# EAGLE design ClockCtrl (EAGLE 9.6.2)

## Sheet 1 of 2
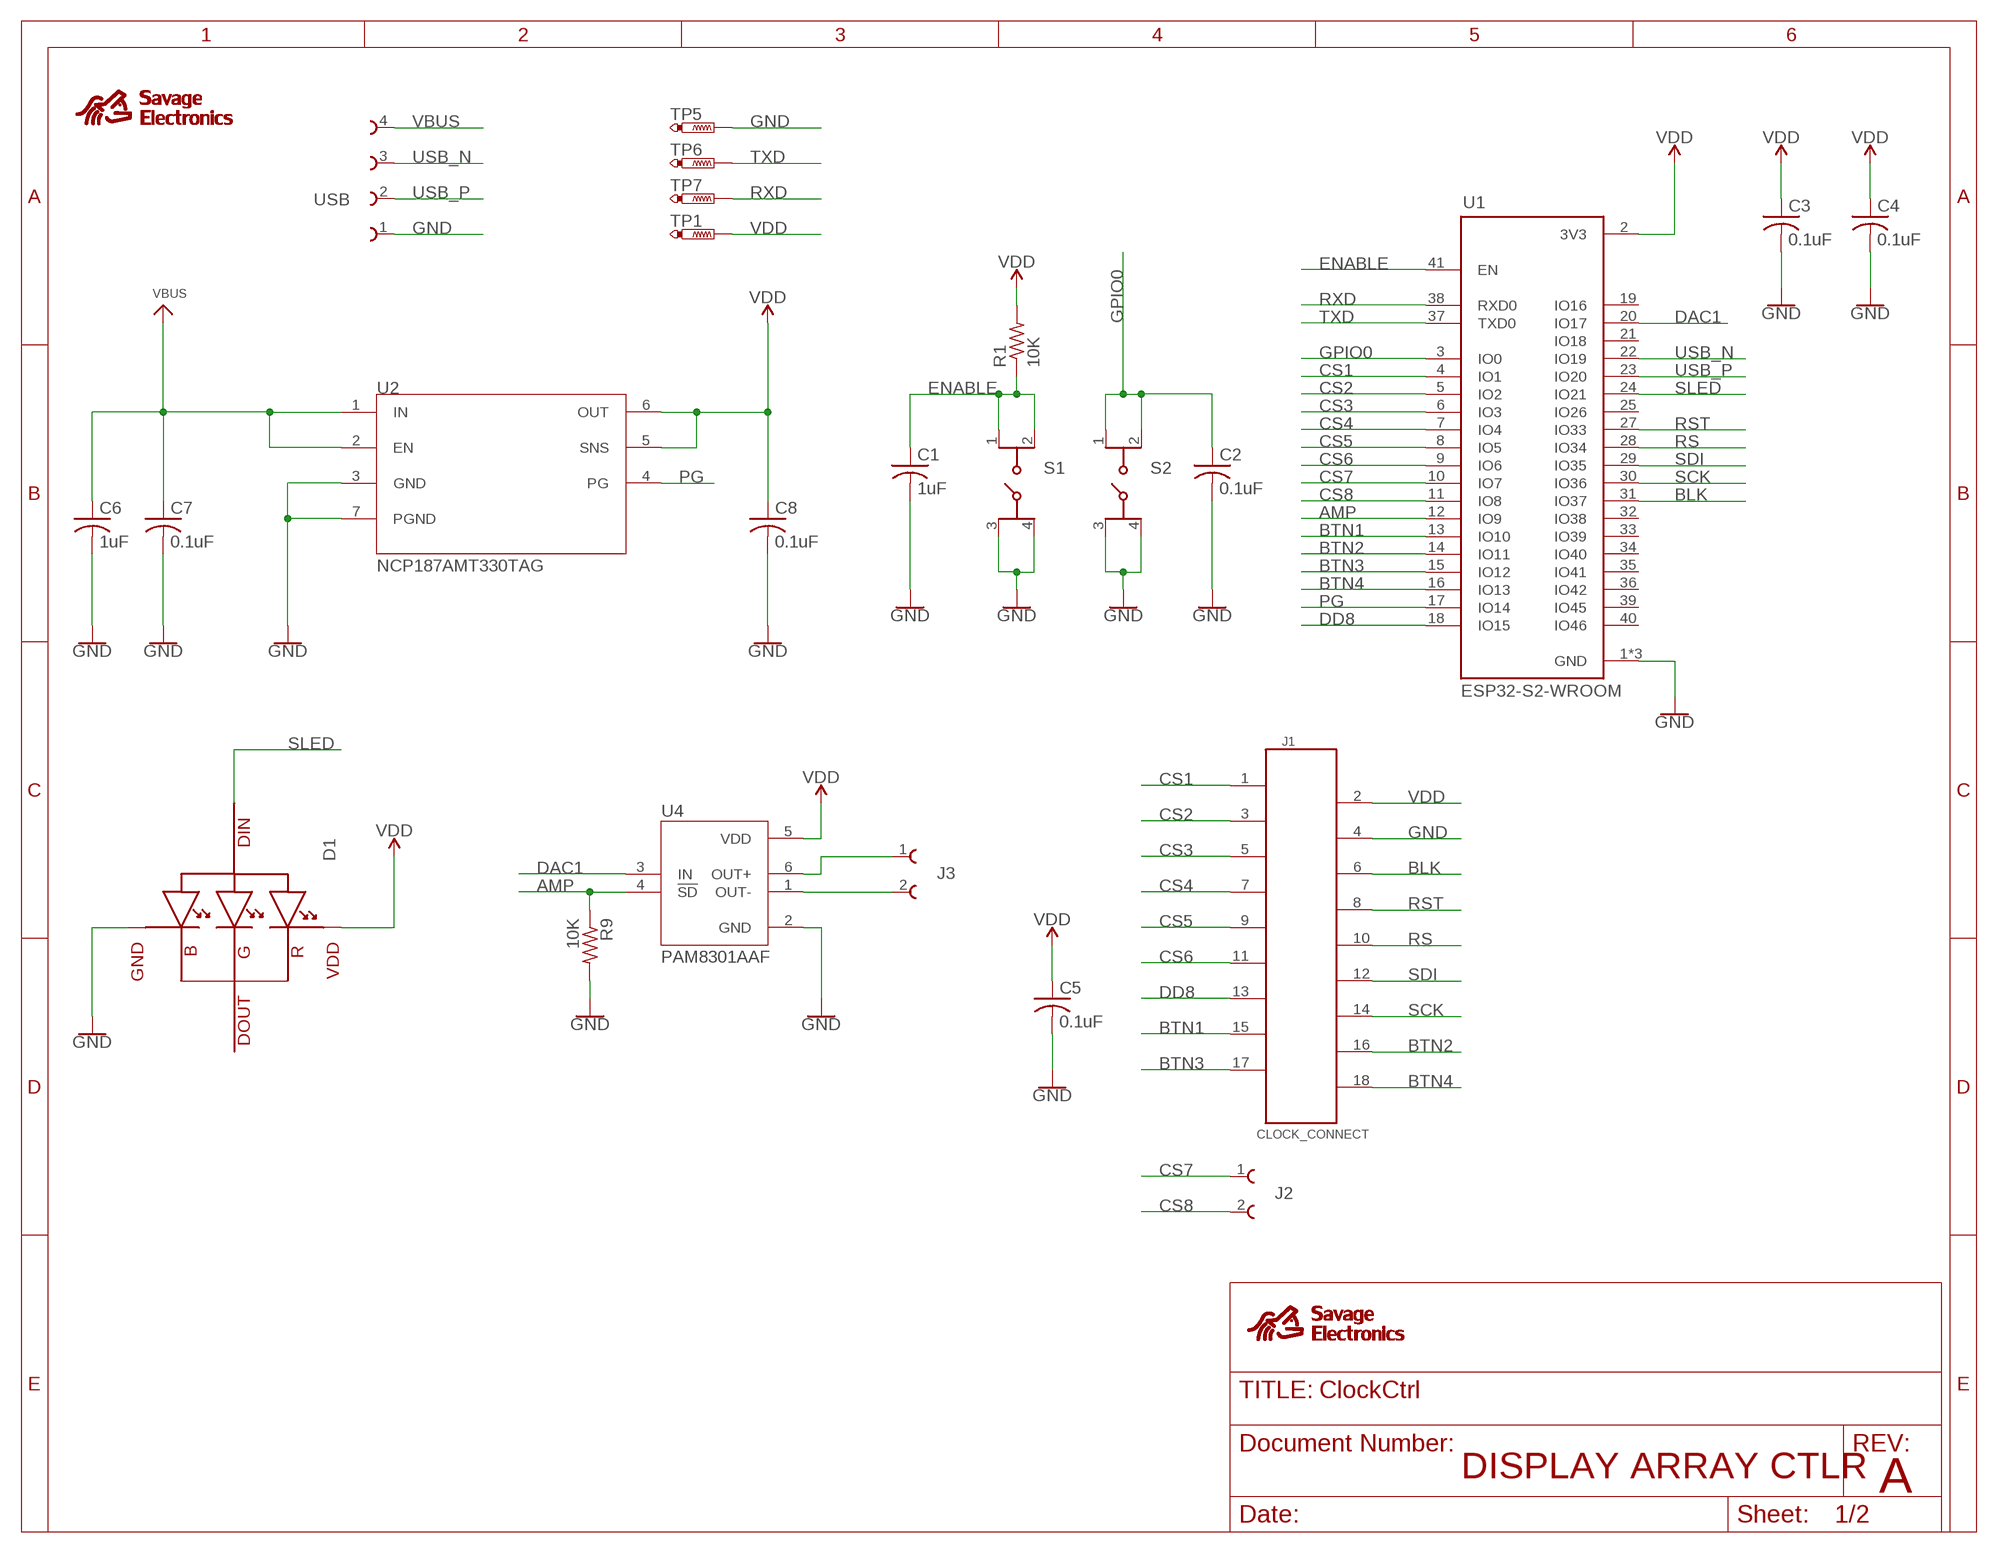
[diagram p0: schematic, sheet 1]

### Parts
C1  1uF  C-USC0805  [C0805]
C2  0.1uF  C-USC0603  [C0603]
C3  0.1uF  C-USC0603  [C0603]
C4  0.1uF  C-USC0603  [C0603]
C5  0.1uF  C-USC0603  [C0603]
C6  1uF  C-USC0603  [C0603]
C7  0.1uF  C-USC0603  [C0603]
C8  0.1uF  C-USC0603  [C0603]
D1  SK6812  [20X20]
J1  CLOCK_CONNECT  [CLOCKC_FOOTPRINT]
J2  62000211121  [62000211121]
J3  62000211121  [62000211121]
R1  10K  R-US_R0603  [R0603]
R9  10K  R-US_R0603  [R0603]
S1  434123025826  [434123025826]
S2  434123025826  [434123025826]
TP1  PTR1TP12R  [TP12R]
TP5  PTR1TP12R  [TP12R]
TP6  PTR1TP12R  [TP12R]
TP7  PTR1TP12R  [TP12R]
U1  ESP32-S2-WROOM  [XCVR_ESP32-S2-WROOM]
U2  NCP187AMT330TAG  [SON65P250X250X80-7N]
U4  PAM8301AAF  [SOT95P280X145-6N]
U$1  SE_SMALL_FSILK  [SE_SMALL_FACESILK]
U$3  SE_SMALL_SILK  [SE_SMALL_SILK]
USB  62000411121  [62000411121]

### Nets
AMP: R9.1 U1.12(IO9) U4.4(!SD)
BLK: J1.6 U1.31(IO37)
BTN1: J1.15 U1.13(IO10)
BTN2: J1.16 U1.14(IO11)
BTN3: J1.17 U1.15(IO12)
BTN4: J1.18 U1.16(IO13)
CS1: J1.1 U1.4(IO1)
CS2: J1.3 U1.5(IO2)
CS3: J1.5 U1.6(IO3)
CS4: J1.7 U1.7(IO4)
CS5: J1.9 U1.8(IO5)
CS6: J1.11 U1.9(IO6)
CS7: J2.1 U1.10(IO7)
CS8: J2.2 U1.11(IO8)
DAC1: U1.20(IO17) U4.3(IN)
DD8: J1.13 U1.18(IO15)
ENABLE: C1.1 R1.1 S1.1 S1.2 U1.41(EN)
GND: C1.2 C2.2 C3.2 C4.2 C5.2 C6.2 C7.2 C8.2 D1.3(GND) J1.4 R9.2 S1.3 S1.4 S2.3 S2.4 TP5.TP U1.1(GND) U1.26(GND) U1.42(GND) U2.3(GND) U2.7(PGND) U4.2(GND) USB.1
GPIO0: C2.1 S2.1 S2.2 U1.3(IO0)
N$5: J3.2 U4.1(OUT-)
N$9: J3.1 U4.6(OUT+)
PG: U1.17(IO14) U2.4(PG)
RS: J1.10 U1.28(IO34)
RST: J1.8 U1.27(IO33)
RXD: TP7.TP U1.38(RXD0)
SCK: J1.14 U1.30(IO36)
SDI: J1.12 U1.29(IO35)
SLED: D1.4(DIN) U1.24(IO21)
TXD: TP6.TP U1.37(TXD0)
USB_N: U1.22(IO19) USB.3
USB_P: U1.23(IO20) USB.2
VBUS: C6.1 C7.1 U2.1(IN) U2.2(EN) USB.4
VDD: C3.1 C4.1 C5.1 C8.1 D1.1(VDD) J1.2 R1.2 TP1.TP U1.2(3V3) U2.5(SNS) U2.6(OUT) U4.5(VDD)
Unconnected: D1.2(DOUT) U1.19(IO16) U1.21(IO18) U1.25(IO26) U1.32(IO38) U1.33(IO39) U1.34(IO40) U1.35(IO41) U1.36(IO42) U1.39(IO45) U1.40(IO46)

### Notes on the sheet
- DISPLAY ARRAY CTLR
- A

## Sheet 2 of 2
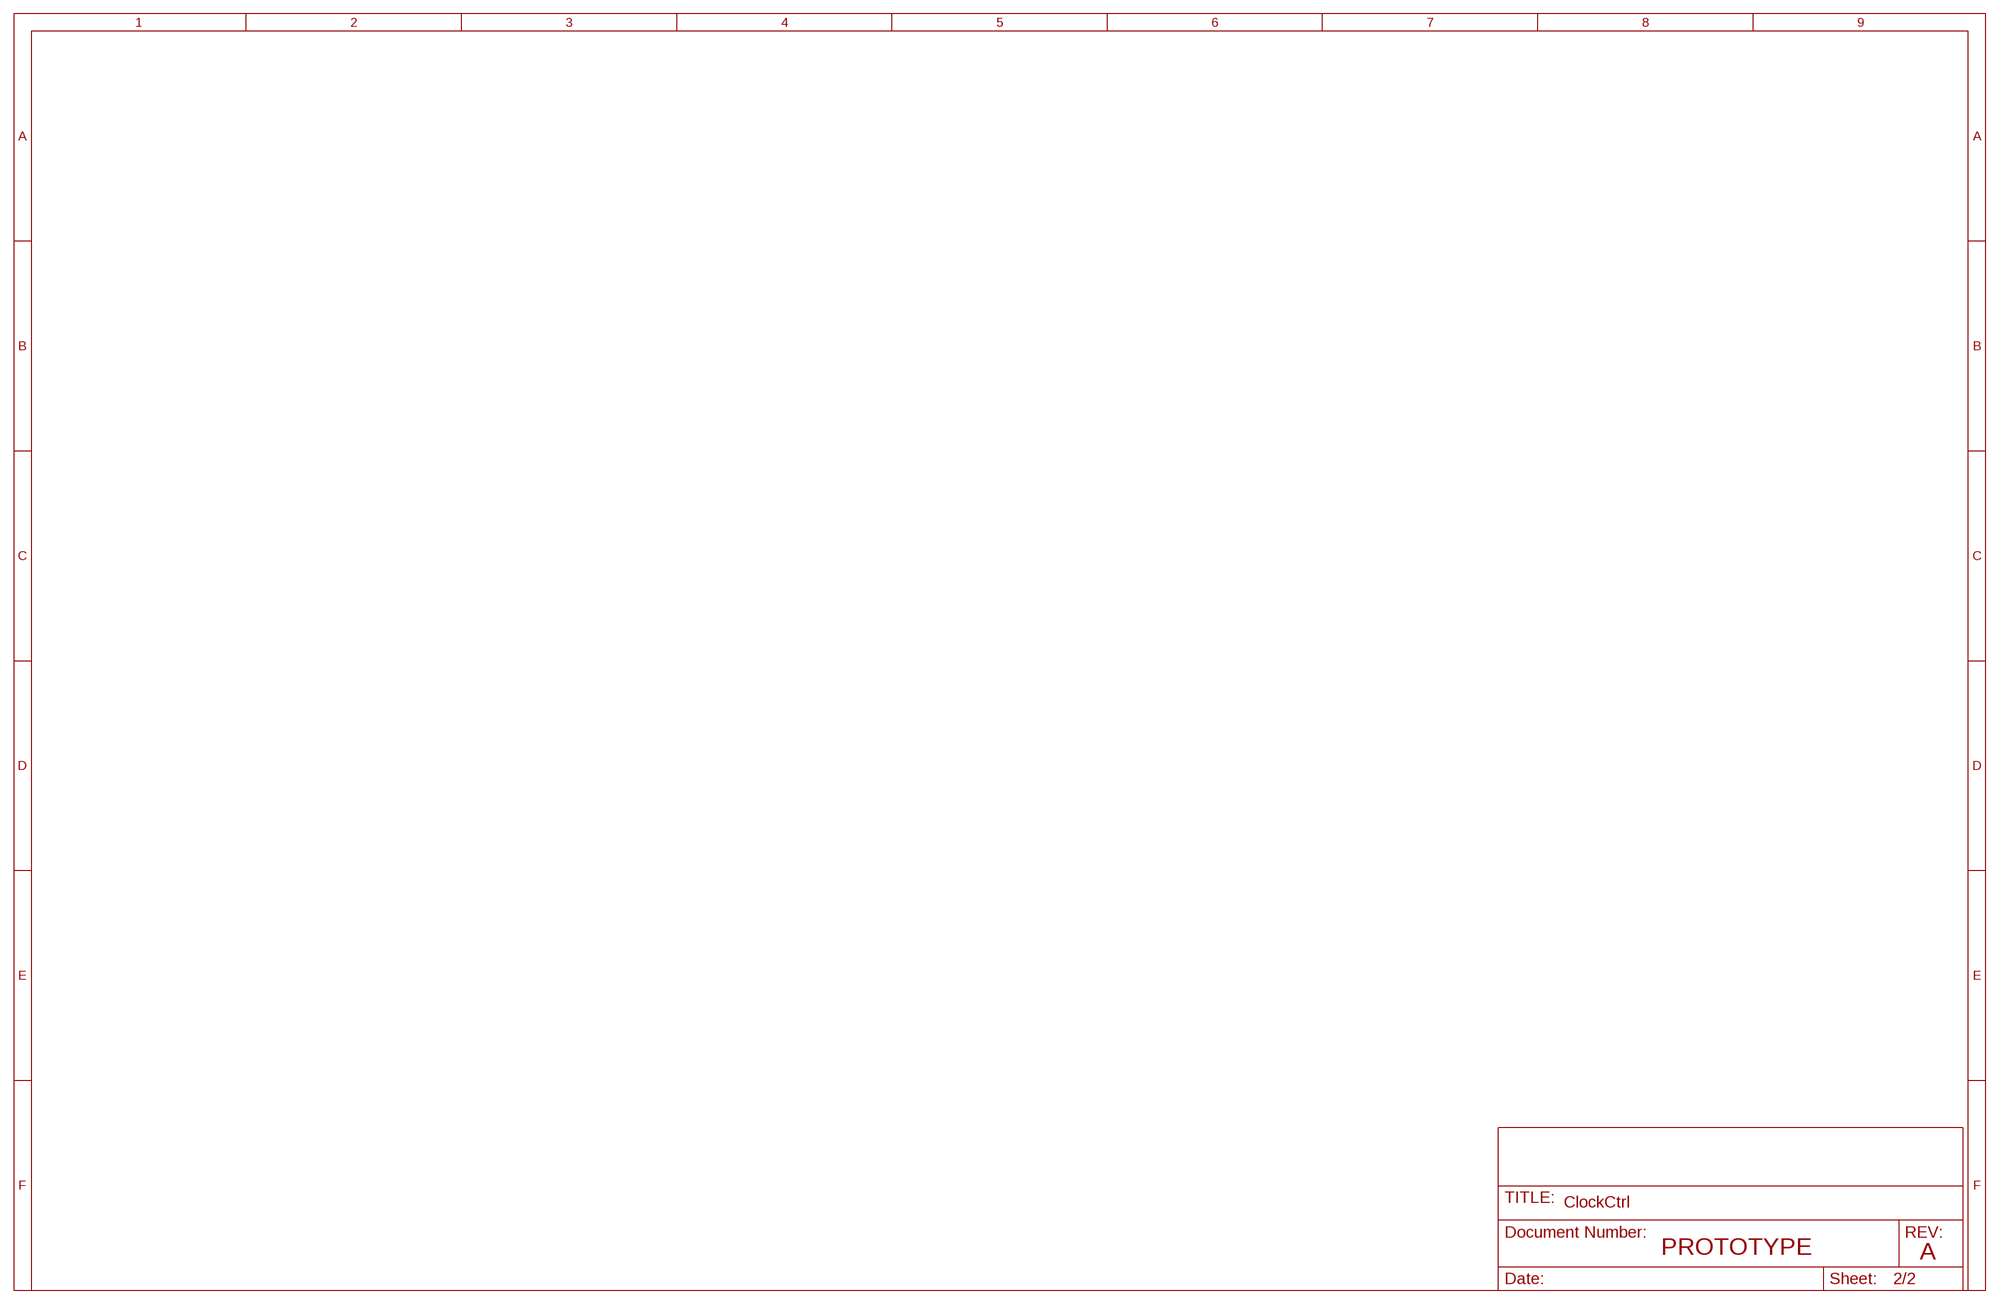
[diagram p1: schematic, sheet 2]

### Notes on the sheet
- PROTOTYPE | A

## Library data of the parts
C1-C8 = Adafruit:C-US: CAPACITOR, American symbol
D1 = ledRGB:SK6812
J1 = Eagle_BOARD-TO-BOARD_CONNECTORS (rev18b):CLOCK_CONNECT
J2 J3 = Eagle_BOARD-TO-BOARD_CONNECTORS (rev18b):62000211121: WR-PHD 2.00mm Pin Header, 2 Pins=>Code : Con_BTB_PHD_2.00_1_THT_62000211121 <http://katalog.we-online.de/media/images/eican/Con_BTB_PHD_2.00_1_THT_6200xx11121_pf2.jpg> Details see: http://katalog.we-online.de/en/em/620_0xx_111_21 Created 2014-06-03, Karrer Zheng 2014 (C) Würth Elektronik
R1 R9 = Adafruit:R-US_: RESISTOR, American symbol
S1 S2 = Eagle_SWITCHES (rev18c):434123025826: 4.2 x 3.2 mm J-Bend SMD Tact Switch WS-TASV MATERIAL PROPERTIES: Cover Material Stainless Steel Actuator Material LCP Actuator Flammability Rating UL94 V-0 Actuator Color White;​ Black Frame Material LCP Frame Flammability Rating UL94 V-0 Frame Color Black Contact Material Stainless Steel Contact Plating Silver Terminal Material Copper Alloy Terminal Plating Silver ELECTRICAL PROPERTIES: Rated Current [1] 50 mA Rated Voltage 16 V (DC) Contact Resistance Initial 500 mΩ Contact Resistance After Life Test 1 Ω Insulation Resistance 100 MΩ Withstanding Voltage 250 V (AC) Bounce 10 ms MECHANICAL PROPERTIES: Operation Force 260 g;​ 160 g Life Cycle 50000 Times;​ 100000 Times GENERAL INFORMATION: Operating Temperature -40 °C up to +85 °C Storage Temperature (in original packaging) -40 °C up to +85 °C PACKAGING PROPERTIES: Packaging Tape and Reel Packaging Unit (Qty.) 2900 <http://katalog.we-online.de/media/images/v2/Family_WS-TASV-4341x30258x6_Gruppe.jpg> Details see: http://katalog.we-online.de/em/datasheet/434123025826.pdf 2017(C) Wurth Elektronik
TP1 TP5-TP7 = TestPoints:PTR1: TEST PIN
U1 = ESP32-S2-WROOM:ESP32-S2-WROOM: WiFi 802.11b/g/n Transceiver Module 2.4GHz PCB Trace Surface Mount Check prices <https://pricing.snapeda.com/parts/ESP32-S2-WROOM/Espressif%20Systems/view-part?ref=eda>; AVAILABILITY: Bad; DESCRIPTION: WiFi 802.11b/g/n Transceiver Module 2.4GHz PCB Trace Surface Mount; MF: Espressif Systems; MP: ESP32-S2-WROOM; PACKAGE: None; PRICE: None
U2 = NCP187AMT330TAG:NCP187AMT330TAG
U4 = PAM8301AAF:PAM8301AAF: Audio Amp Speaker 1-CH Mono 1.5W Class-D 6-Pin TSOT-26 T/R Check prices <https://pricing.snapeda.com/parts/PAM8301AAF/Diodes%20Inc./view-part?ref=eda>; AVAILABILITY: Good; DESCRIPTION: Amplifier IC 1-Channel (Mono) Class D SOT-23-6; MF: Diodes Inc.; MP: PAM8301AAF; PACKAGE: SOT-23 Diodes Inc.; PRICE: None; PURCHASE-URL: https://pricing.snapeda.com/search/part/PAM8301AAF/?ref=eda
U$1 = SE_NEWLOGO:SE_SMALL_FSILK
U$3 = SE_NEWLOGO:SE_SMALL_SILK
USB = Eagle_BOARD-TO-BOARD_CONNECTORS (rev18b):62000411121: WR-PHD 2.00mm Pin Header, 4 Pins=>Code : Con_BTB_PHD_2.00_1_THT_62000411121 <http://katalog.we-online.de/media/images/eican/Con_BTB_PHD_2.00_1_THT_6200xx11121_pf2.jpg> Details see: http://katalog.we-online.de/en/em/620_0xx_111_21 Created 2014-06-03, Karrer Zheng 2014 (C) Würth Elektronik

## Board
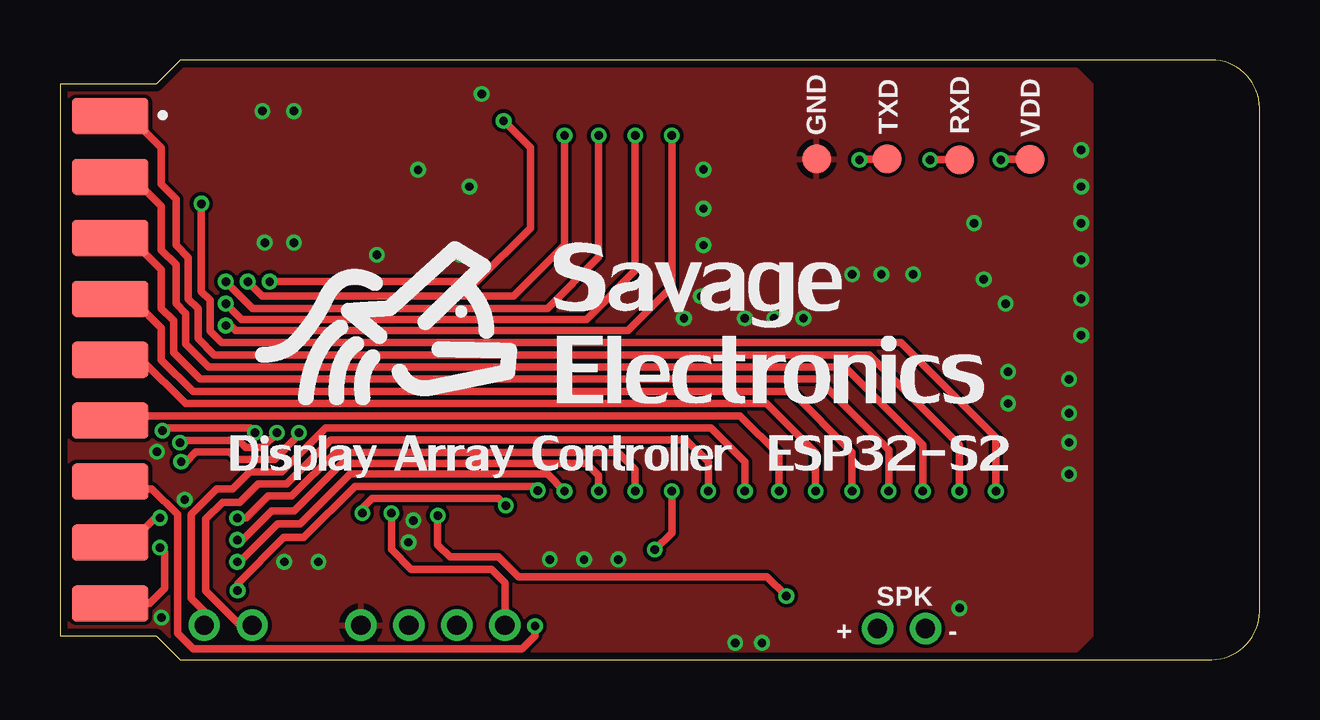
[diagram p2: board, top side]
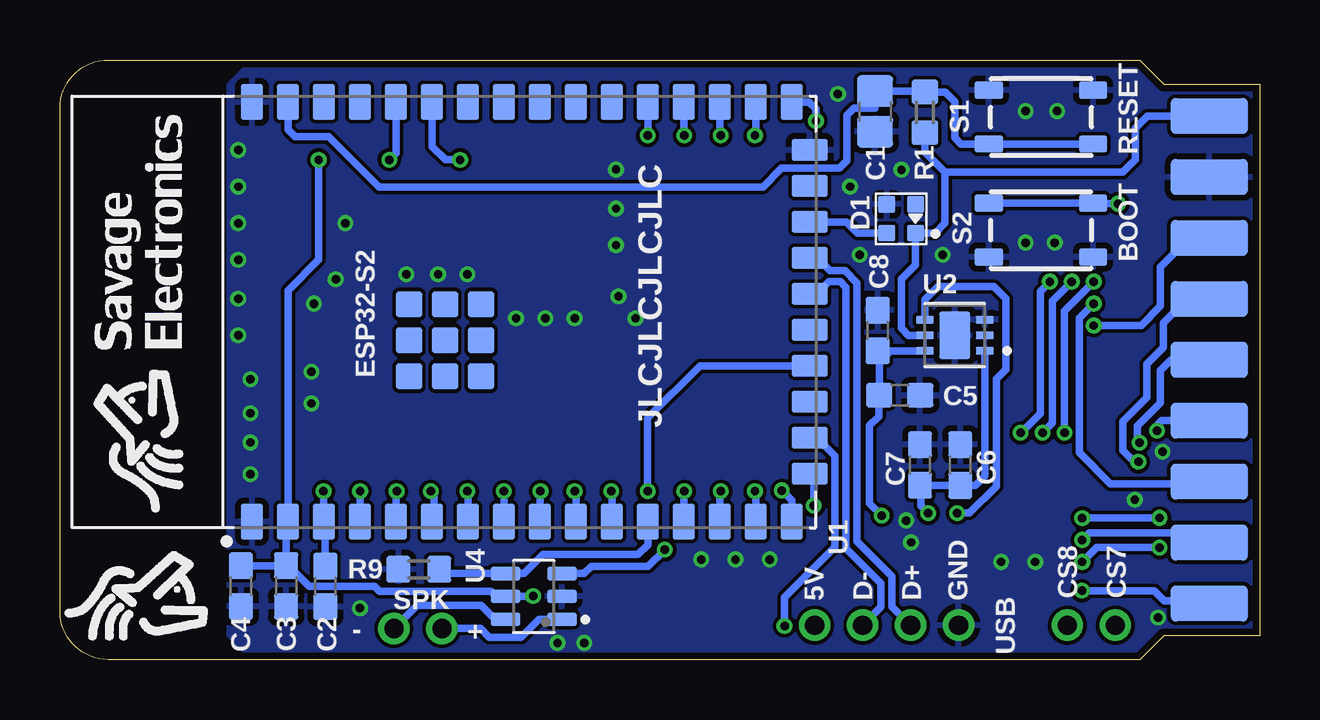
[diagram p3: board, bottom side, seen from below]

Size 50 x 25 mm. Coordinates in mm from the lower left corner, seen from the top.
Outline: 0,1 4,1 5,0 48,0 arc90 50,2 50,23 arc90 48,25 5,25 4,24 0,24 0,1
Copper layers (1*16): Top 0.035mm / dielectric 1.5mm / Bottom 0.035mm
Design rules "default *": minimum track width 5mil, minimum drill 0.3mm, track to track 6mil, track to pad 5mil, pad to pad 5mil, via to via 5mil, smd to smd 5mil, copper to edge 12mil, drill to drill 6mil, minimum pad ring 10mil, minimum via ring 6mil, stop-mask expansion 2mil, vias tented up to drill 20mil, thermal gap 10mil

### Footprints (pad centres in the part's own frame; a part is rotated, then mirrored left to right if it is on the bottom)
C0805 = smd 1.3 x 1.5: 1 -0.85,0; 2 0.85,0
C0603 = smd 1.1 x 1: 1 -0.85,0; 2 0.85,0
20X20 = smd 0.7 x 0.7: 1 0.6,-0.6; 2 0.6,0.6; 3 -0.6,0.6; 4 -0.6,-0.6
CLOCKC_FOOTPRINT = smd 1.5 x 3.2: 1 -10.16,-1.905; 3 -7.62,-1.905; 5 -5.08,-1.905; 7 -2.54,-1.905; 9 0,-1.905; 11 2.54,-1.905; 13 5.08,-1.905; 15 7.62,-1.905; 17 10.16,-1.905 | smd 1.5 x 3.2 bottom: 2 -10.16,-1.905; 4 -7.62,-1.905; 6 -5.08,-1.905; 8 -2.54,-1.905; 10 0,-1.905; 12 2.54,-1.905; 14 5.08,-1.905; 16 7.62,-1.905; 18 10.16,-1.905
62000211121 = drill 0.8: 1 -1,0; 2 1,0
R0603 = smd 1 x 1.1: 1 -0.85,0; 2 0.85,0
434123025826 = smd 1.168 x 0.711: 1 -2.175,1.121; 2 2.175,1.121; 3 -2.175,-1.121; 4 2.175,-1.121
TP12R = smd 1.2 x 1.2: TP 0,0
XCVR_ESP32-S2-WROOM = smd 1.5 x 0.9: 1 -8.75,8; 2 -8.75,6.5; 3 -8.75,5; 4 -8.75,3.5; 5 -8.75,2; 6 -8.75,0.5; 7 -8.75,-1; 8 -8.75,-2.5; 9 -8.75,-4; 10 -8.75,-5.5; 11 -8.75,-7; 12 -8.75,-8.5; 13 -8.75,-10; 14 -8.75,-11.5; 15 -8.75,-13; 16 -8.75,-14.5; 27 8.75,-14.5; 28 8.75,-13; 29 8.75,-11.5; 30 8.75,-10; 31 8.75,-8.5; 32 8.75,-7; 33 8.75,-5.5; 34 8.75,-4; 35 8.75,-2.5; 36 8.75,-1; 37 8.75,0.5; 38 8.75,2; 39 8.75,3.5; 40 8.75,5; 41 8.75,6.5; 42 8.75,8 | smd 0.9 x 1.5: 17 -6.75,-15.25; 18 -5.25,-15.25; 19 -3.75,-15.25; 20 -2.25,-15.25; 21 -0.75,-15.25; 22 0.75,-15.25; 23 2.25,-15.25; 24 3.75,-15.25; 25 5.25,-15.25; 26 6.75,-15.25 | smd 1.1 x 1.1: 43.1 -1.19,-0.05; 43.2 -2.69,-0.05; 43.3 0.31,-0.05; 43.4 -2.69,-1.55; 43.5 -1.19,-1.55; 43.6 0.31,-1.55; 43.7 -2.69,1.45; 43.8 -1.19,1.45; 43.9 0.31,1.45
SON65P250X250X80-7N = smd 0.74 x 0.32: 1 -1.245,0.65; 2 -1.245,0; 3 -1.245,-0.65; 4 1.245,-0.65; 5 1.245,0; 6 1.245,0.65 | smd 1.3 x 2: 7 0,0
SOT95P280X145-6N = smd 1.219 x 0.559: 1 -1.177,0.95; 2 -1.177,0; 3 -1.177,-0.95; 4 1.177,-0.95; 5 1.177,0; 6 1.177,0.95
62000411121 = drill 0.8: 1 -3,0; 2 -1,0; 3 1,0; 4 3,0

### Placement (x,y rotation side)
C1  16.03,22.86 270 bottom
C2  38.94,3.05 270 bottom
C3  40.58,3.07 270 bottom
C4  42.46,3.06 270 bottom
C5  15,11.02 0 bottom
C6  12.47,8.11 90 bottom
C7  14.15,8.11 90 bottom
C8  15.91,13.72 90 bottom
D1  14.94,18.38 0 bottom
J1  4,12.5 270 top
J2  7.01,1.43 180 bottom
J3  35.08,1.3 0 bottom
R1  13.95,22.82 270 bottom
R9  35.04,3.76 180 bottom
S1  9.11,22.62 180 bottom
S2  9.11,17.91 0 bottom
TP1  40.44,20.86 0 top
TP5  31.54,20.87 0 top
TP6  34.48,20.87 0 top
TP7  37.5,20.84 0 top
U1  34,14.5 90 bottom
U2  12.7,13.52 180 bottom
U4  30.25,2.63 180 bottom
U$1  49.99,0.62 0 bottom
U$3  46.72,14.58 90 bottom
USB  15.54,1.43 0 top

### Tracks (layer width: path | path; a pad name or v marks a point on that pad's centre or on a via)
AMP
  Bottom 0.305: R9.1 34.01,3.58 U4.4 30.66,3.58 29.87,4.38 25.91,4.38 25.5,4.79 U1.12
BLK  (via drill 0.35)
  Top 0.305: v25.5,21.85 25.5,15.55 23.67,13.72 7.32,13.72 7.11,13.93 v6.91,13.93
  Bottom 0.305: U1.31 v25.5,21.85 | v6.91,13.93 6.81,13.93 6.8,13.94 4.93,13.94 4.13,14.74 4.13,16.36 2.91,17.58 J1.6
BTN1  (via drill 0.35)
  Top 0.305: v23.98,7.02 23.98,7.93 23.27,8.64 11.48,8.64 9.65,6.82 8.67,6.82 7.75,5.9 v7.39,5.9 | v4.16,5.91 3.97,5.91 2.94,4.88 J1.15
  Bottom 0.305: U1.13 24,7 v23.98,7.02 | v7.39,5.9 v4.17,5.9 v4.16,5.91
BTN2  (via drill 0.35)
  Top 0.305: v22.45,7.02 22.45,7.68 21.95,8.19 11.73,8.19 9.75,6.21 8.82,6.21 7.61,4.99 v7.39,4.99
  Bottom 0.305: U1.14 22.5,6.97 v22.45,7.02 | v7.39,4.99 7.09,5.29 3.66,5.29 3.25,4.88 J1.16
BTN3  (via drill 0.35)
  Top 0.305: v21.03,7.02 20.32,7.73 12.09,7.73 10.01,5.65 9.06,5.65 7.49,4.07 v7.39,4.07 | v4.16,4.67 4.36,4.47 4.36,2.96 3.74,2.34 J1.17
  Bottom 0.305: U1.15 21,6.99 v21.03,7.02 | v7.39,4.07 6.79,4.67 v4.17,4.67 v4.16,4.67
BTN4  (via drill 0.35)
  Top 0.305: v19.91,7.05 19.74,7.22 12.29,7.22 10.16,5.09 9.33,5.09 7.4,3.16 v7.4,2.87
  Bottom 0.305: U1.16 19.5,6.63 v19.91,7.05 | v7.4,2.87 v7.39,2.86 4.38,2.86 3.96,2.45 2.2,2.45 J1.18
CS1  (via drill 0.35)
  Top 0.305: v37.49,7.02 37.49,8.95 33.73,12.71 6.43,12.71 5.75,13.38 5.75,14.63 5.35,15.04 5.35,16.77 4.84,17.27 4.84,19.21 4.23,19.82 4.23,21.34 2.91,22.66 J1.1
  Bottom 0.305: U1.4 v37.5,7.01 v37.49,7.02
CS2  (via drill 0.35)
  Top 0.305: v35.97,7.02 35.97,8.95 32.72,12.2 6.2,12.2 5.25,13.15 5.25,14.43 4.84,14.84 4.84,16.46 4.23,17.07 4.23,18.9 3.01,20.12 J1.3
  Bottom 0.305: U1.5 36,6.99 v35.97,7.02
CS3  (via drill 0.35)
  Top 0.305: v34.54,7.02 34.54,8.75 31.6,11.69 5.85,11.69 4.74,12.8 4.74,14.13 4.23,14.63 4.23,16.26 2.91,17.58 J1.5
  Bottom 0.305: U1.6 34.4,5.85 34.4,6.87 v34.54,7.02
CS4  (via drill 0.35)
  Top 0.305: v33.02,7.02 33.02,8.64 30.48,11.18 5.55,11.18 4.23,12.5 4.23,13.82 3.01,15.04 J1.7
  Bottom 0.305: U1.7 33,7 v33.02,7.02
CS5  (via drill 0.35)
  Top 0.305: v31.5,7.02 31.5,8.63 29.45,10.67 5.25,10.67 3.42,12.5 J1.9
  Bottom 0.305: U1.8 v31.5,7.01 v31.5,7.02
CS6  (via drill 0.35)
  Top 0.305: v29.97,7.02 29.97,8.54 28.35,10.16 2.3,10.16 J1.11
  Bottom 0.305: U1.9 30,6.99 v29.97,7.02
CS7  (via drill 0.35)
  Top 0.305: v28.55,7.02 28.55,8.24 27.13,9.66 11.07,9.66 9.25,7.83 7.92,7.83 7.2,7.12 6.53,7.12 5.47,6.06 5.47,2.55 6.01,2.01 J2.1
  Bottom 0.305: U1.10 28.5,6.97 v28.55,7.02
CS8  (via drill 0.35)
  Top 0.305: v27.03,7.02 27.03,8.24 26.1,9.16 11.29,9.16 9.45,7.32 8.26,7.32 7.49,6.56 6.79,6.56 6.08,5.86 6.08,2.86 7.51,1.43 J2.2
  Bottom 0.305: U1.11 27,6.99 v27.03,7.02
DAC1  (via drill 0.35)
  Top 0.305: v24.79,4.58 25.5,5.29 v25.5,7.02
  Bottom 0.305: U4.3 28.16,3.58 27.85,3.89 25.48,3.89 v24.79,4.58 | U1.20 23.32,12.25 25.5,10.07 v25.5,7.02
DD8  (via drill 0.35)
  Top 0.305: J1.13 2.4,7.12 3.83,7.12 4.9,6.05 4.9,1.1 5.54,0.46 19.27,0.46 19.8,0.99 v19.8,1.4
  Bottom 0.305: v19.8,1.4 19.8,2.6 17.7,4.7 17.7,8.5 18.45,9.25 U1.18
ENABLE
  Bottom 0.305: S1.1 S1.2 12.45,21.5 12.7,21.75 12.7,23.27 13.1,23.67 R1.1 13.99,23.71 C1.1 16.03,23 16.9,23 17.2,22.7 17.2,20.8 17.52,20.48 19.92,20.48 20.7,19.7 36.7,19.7 38.8,21.8 40.2,21.8 40.5,22.1 U1.41
GND  (via drill 0.35)
  other vias: 14.73,5.8 14.53,4.88 29.26,0.69 28.14,0.69 9.35,4.07 10.77,4.07 9.75,22.87 8.43,22.87 9.75,17.38 8.53,17.38 13.21,16.87 16.66,16.87 17.07,19.72 14.93,20.42 17.58,23.58 26.01,14.23 26.72,15.15 26.82,17.28 26.82,18.8 26.82,20.43 42.06,7.73 42.06,9.05 42.06,10.27 42.06,11.69 42.57,13.52 42.57,15.04 42.57,16.67 42.57,18.19 42.57,19.72 42.57,21.24 39.42,14.84 38.51,15.86 38.1,18.19 39.52,10.68 39.52,12 30.99,14.23 29.77,14.23 28.55,14.23 35.56,16.06 34.24,16.06 33.02,16.06 37.49,2.14 23.27,4.17 21.84,4.17 20.42,4.17 4.05,8.67 5.2,6.67 4.22,1.75
  pour Top: 0,25 42,25 43,24 43,1 42,0 0,0
  pour Bottom: 0,25 42,25 43,24 43,1 42,0 0,0
GPIO0  (via drill 0.35)
  Top 0.305: v39.01,7.02 39.01,9.25 35.05,13.22 6.74,13.22 6.26,13.7 6.26,14.98 5.89,15.35 v5.89,19.01
  Bottom 0.305: C2.1 38.94,5.69 U1.3 39.01,5.76 v39.01,7.02 | S2.1 7.11,19.03 | 7.11,19.03 S2.2 | v5.89,19.01 7.09,19.01 7.11,19.03
N$5
  Bottom 0.305: J3.2 32.48,1.29 32.1,0.92 30.79,0.92 30.02,1.68 U4.1
N$9
  Bottom 0.305: U4.6 31.87,1.68 32.45,2.26 35.11,2.26 J3.1
PG  (via drill 0.35)
  Top 0.305: v18.58,6.41 18.28,6.71 13.01,6.71 12.6,6.31 v12.6,6.11
  Bottom 0.305: U1.17 18.58,7.58 v18.58,6.41 | U2.4 13.95,15.02 13.41,15.55 11.07,15.55 10.57,15.04 10.57,12.1 10.97,11.69 10.97,7.22 12.09,6.11 v12.6,6.11
RS  (via drill 0.35)
  Top 0.305: v21.03,21.85 21.03,17.28 18.9,15.15 8.44,15.15 v7.83,15.76 | v9.04,9.46 8.43,8.85 7.74,8.85 7.44,9.15 5.1,9.15 v5,9.04
  Bottom 0.305: U1.28 21,21.88 v21.03,21.85 | v9.04,9.46 8.64,9.86 8.64,14.94 v7.83,15.76 | J1.10 3.69,12.5 4.14,12.05 4.14,10.7 5.1,9.74 5.1,9.14 v5,9.04
RST  (via drill 0.35)
  Top 0.305: v18.49,22.46 19.61,21.34 19.61,17.99 17.37,15.76 v8.74,15.76 | v9.96,9.46 9.96,9.36 8.95,8.35 7.39,8.35 7.08,8.65 5.66,8.65 5.25,8.25 v5.05,8.25
  Bottom 0.305: U1.27 18.77,23.25 18.49,22.97 v18.49,22.46 | v8.74,15.76 9.14,15.35 9.14,10.27 v9.96,9.46 | v5.05,8.25 5.22,8.25 5.7,8.72 5.7,9.92 4.7,10.92 4.7,12.32 4.01,13.01 4.01,14.04 3.01,15.04 J1.8
RXD  (via drill 0.35)
  Top 0.305: v36.27,20.84 v36.28,20.84 TP7.TP
  Bottom 0.305: U1.38 36,21.11 v36.27,20.84
SCK  (via drill 0.35)
  Top 0.305: v23.98,21.85 23.98,16.21 21.95,14.18 7.57,14.18 v6.91,14.84
  Bottom 0.305: U1.30 24,21.87 v23.98,21.85 | v6.91,14.84 7.52,14.23 7.52,8.63 6.21,7.32 2.19,7.32 J1.14
SDI  (via drill 0.35)
  Top 0.305: v22.45,21.85 22.45,16.77 20.32,14.64 8.03,14.64 v6.91,15.76 | v8.13,9.46 7.93,9.65 4.38,9.65 v4.27,9.54
  Bottom 0.305: U1.29 22.5,21.9 v22.45,21.85 | v6.91,15.76 8.13,14.54 v8.13,9.46 | v4.27,9.54 4.38,9.65 4.07,9.96 J1.12
SLED
  Bottom 0.305: U1.24 17.23,18.25 16.76,17.78 D1.4
TXD  (via drill 0.35)
  Top 0.305: TP6.TP 33.36,20.87 v33.33,20.84
  Bottom 0.305: U1.37 34.49,21.39 33.93,20.84 v33.33,20.84
USB_N
  Bottom 0.305: U1.22 18.45,15.25 17.94,15.76 17.48,15.76 17.23,15.51 17.23,4.64 15.77,3.18 15.77,2.2 USB.3
USB_P
  Bottom 0.305: U1.23 18.45,16.75 17.91,16.21 17.29,16.21 16.77,15.7 16.77,4.93 15.32,3.47 15.32,2.2 USB.2
VBUS  (via drill 0.35)
  Top 0.305: USB.4 18.55,3.21 17.98,3.77 14.63,3.77 13.81,4.58 v13.81,6.1
  Bottom 0.152: U2.1 U2.2
  Bottom 0.305: U2.1 11.46,7.65 11.85,7.26 C6.1 C7.1 14.12,7.24 14.12,6.41 v13.82,6.1 v13.81,6.1
VDD  (via drill 0.35)
  Top 0.305: v39.22,20.84 39.24,20.86 TP1.TP | v30.28,2.65 29.48,3.45 19.11,3.45 18.29,4.28 16.26,4.28 15.75,4.78 v15.75,6
  Bottom 0.152: U2.6 U2.5
  Bottom 0.305: C3.1 40.58,5.67 U1.2 40.5,15.39 39.22,16.67 v39.22,20.84 | C4.1 C3.1 | J1.2 4.67,22.66 5.18,22.16 5.18,20.84 5.69,20.33 13.11,20.33 | R1.2 13.95,21.17 13.11,20.33 | 13.11,20.33 13.11,18.19 13.52,17.78 D1.1 14.34,16.46 14.94,15.86 14.94,13.83 14.63,13.52 U2.5 | C3.1 40.47,3.92 39.61,3.05 36.89,3.05 36.68,2.84 32.03,2.84 31.82,2.63 U4.5 30.29,2.63 v30.28,2.65 | 15.85,12.8 C5.1 15.87,10.99 15.87,10.15 16.26,9.76 16.26,6.51 v15.75,6 | 15.85,12.8 15.65,12.6 15.38,12.87 U2.6 | 15.85,12.8 C8.1

### Text on the board
tPlace: GND | TXD | RXD | VDD | SPK | + | -
bPlace: RESET | BOOT | ESP32-S2 | JLCJLCJLCJLC | CS7 | CS8 | GND | D+ | D- | 5V | SPK | + | -